# EAGLE design owl (EAGLE 6.4)
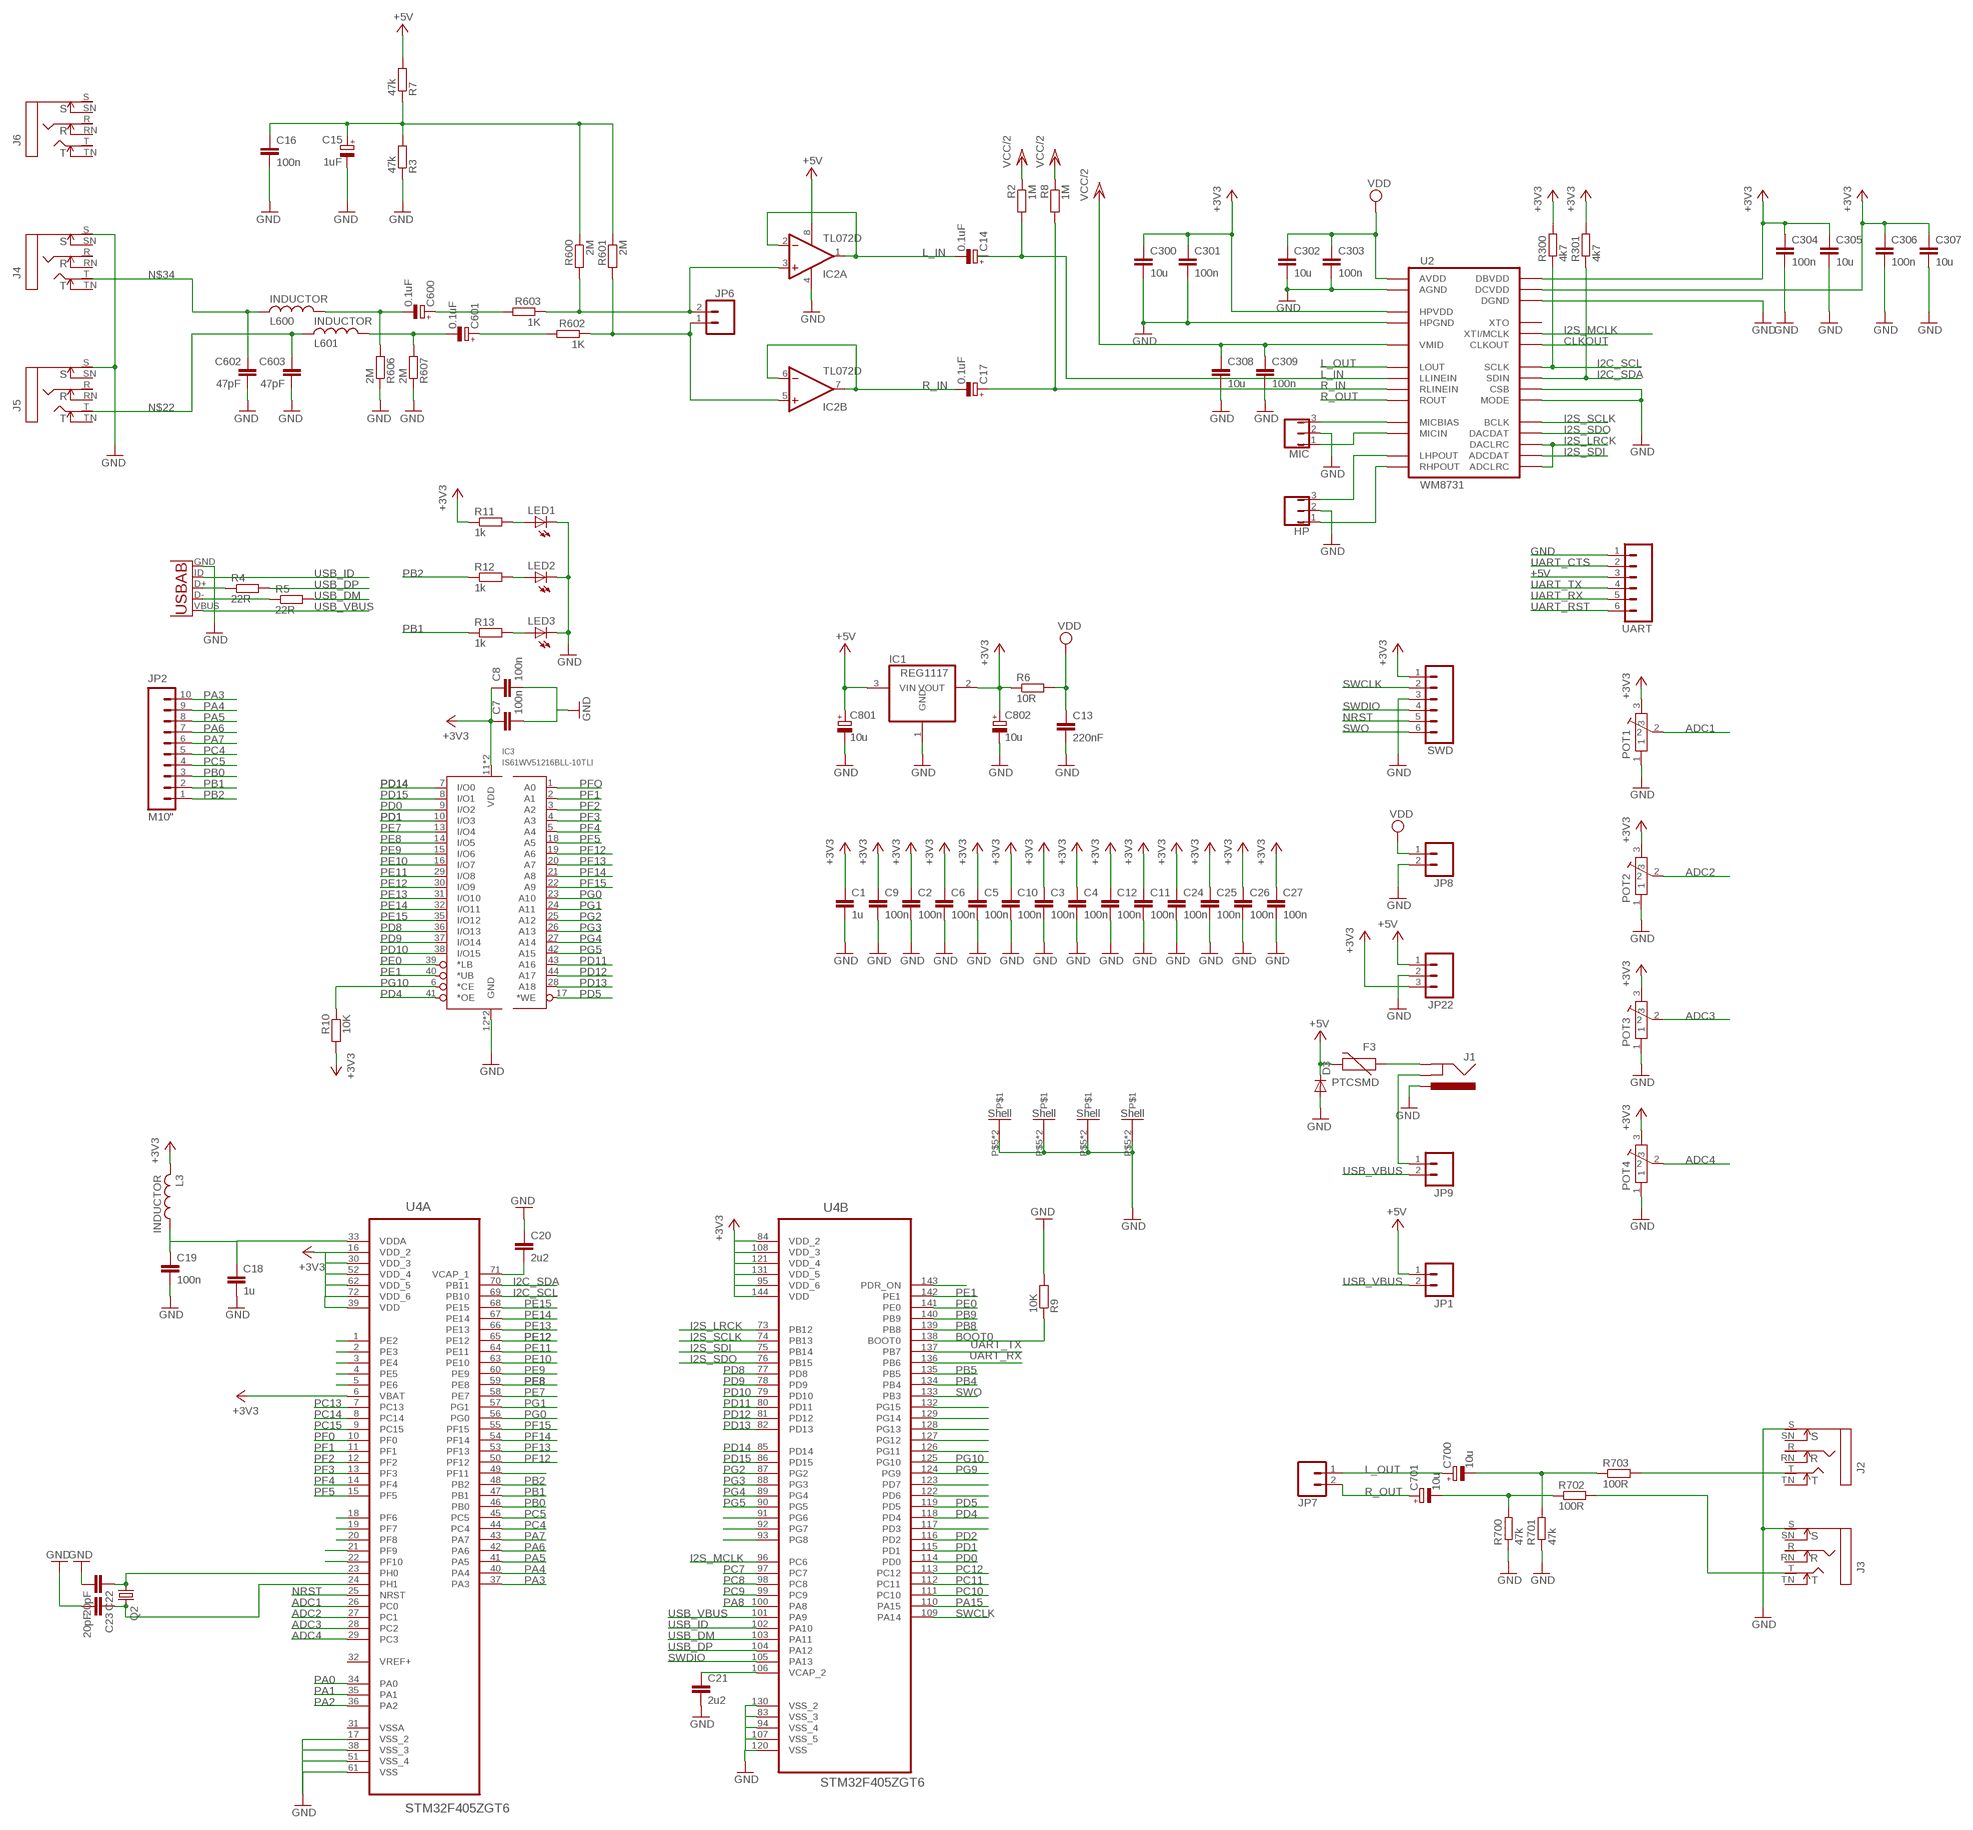
[diagram p0: schematic, sheet 1]

## Parts
C1  1u  C-EUC0603  [C0603]
C2  100n  C-EUC0603  [C0603]
C3  100n  C-EUC0603  [C0603]
C4  100n  C-EUC0603  [C0603]
C5  100n  C-EUC0603  [C0603]
C6  100n  C-EUC0603  [C0603]
C7  100n  C-EUC0603  [C0603]
C8  100n  C-EUC0603  [C0603]
C9  100n  C-EUC0603  [C0603]
C10  100n  C-EUC0603  [C0603]
C11  100n  C-EUC0603  [C0603]
C12  100n  C-EUC0603  [C0603]
C13  220nF  C-EUC0603  [C0603]
C14  0.1uF  CPOL-EUA  [PANASONIC_A]
C15  1uF  CPOL-EUA  [PANASONIC_A]
C16  100n  C-EUC0603  [C0603]
C17  0.1uF  CPOL-EUA  [PANASONIC_A]
C18  1u  C-EUC0603  [C0603]
C19  100n  C-EUC0603  [C0603]
C20  2u2  C-EUC0603  [C0603]
C21  2u2  C-EUC0603  [C0603]
C22  20pF  C-EUC0603  [C0603]
C23  20pF  C-EUC0603  [C0603]
C24  100n  C-EUC0603  [C0603]
C25  100n  C-EUC0603  [C0603]
C26  100n  C-EUC0603  [C0603]
C27  100n  C-EUC0603  [C0603]
C300  10u  C-EUC1206  [C1206]
C301  100n  C-EUC0603  [C0603]
C302  10u  C-EUC1206  [C1206]
C303  100n  C-EUC0603  [C0603]
C304  100n  C-EUC0603  [C0603]
C305  10u  C-EUC1206  [C1206]
C306  100n  C-EUC0603  [C0603]
C307  10u  C-EUC1206  [C1206]
C308  10u  C-EUC1206  [C1206]
C309  100n  C-EUC0603  [C0603]
C600  0.1uF  CPOL-EUA  [PANASONIC_A]
C601  0.1uF  CPOL-EUA  [PANASONIC_A]
C602  47pF  C-EUC0603  [C0603]
C603  47pF  C-EUC0603  [C0603]
C700  10u  CPOL-EUA  [PANASONIC_A]
C701  10u  CPOL-EUA  [PANASONIC_A]
C801  10u  CPOL-EUA  [PANASONIC_A]
C802  10u  CPOL-EUA  [PANASONIC_A]
D3  DIODESMA  [SMA-DIODE]
F3  PTCSMD  [PTC-1206]
HP  JMP/3P/SIP  [JMP/3P/SIP]
IC1  REG1117  [SOT223]
IC2  TL072D  [SO08]
IC3  IS61WV51216BLL-10TLI  [TSOP44-II]
J1  POWER_JACKPTH  [POWER_JACK_PTH]
J2  NEUTRIK_NMJ6HCD2  [NMJ6HCD2]
J3  NEUTRIK_NMJ6HCD2  [NMJ6HCD2]
J4  NEUTRIK_NMJ6HCD2  [NMJ6HCD2]
J5  NEUTRIK_NMJ6HCD2  [NMJ6HCD2]
J6  NEUTRIK_NMJ6HCD2  [NMJ6HCD2]
JP1  M02PTH  [1X02]
JP2  M10"  [1X10]
JP6  M02PTH  [1X02]
JP7  M02PTH  [1X02]
JP8  M02PTH  [1X02]
JP9  M02PTH  [1X02]
JP22  M03PTH  [1X03]
L3  INDUCTOR  [0603]
L600  INDUCTOR  [0603]
L601  INDUCTOR  [0603]
LED1  LED1206  [LED-1206]
LED2  LED1206  [LED-1206]
LED3  LED3MM  [LED3MM]
MIC  JMP/3P/SIP  [JMP/3P/SIP]
POT1  POT-ALPS-RK09L1140  [POT-ALPS-RK09L1140]
POT2  POT-ALPS-RK09L1140  [POT-ALPS-RK09L1140]
POT3  POT-ALPS-RK09L1140  [POT-ALPS-RK09L1140]
POT4  POT-ALPS-RK09L1140  [POT-ALPS-RK09L1140]
Q2  CRYSTALHC49UP  [HC49UP]
R2  1M  R-EU_R0603  [R0603]
R3  47k  R-EU_R0603  [R0603]
R4  22R  R-EU_R0603  [R0603]
R5  22R  R-EU_R0603  [R0603]
R6  10R  R-EU_R0603  [R0603]
R7  47k  R-EU_R0603  [R0603]
R8  1M  R-EU_R0603  [R0603]
R9  10K  R-EU_R0603  [R0603]
R10  10K  R-EU_R0603  [R0603]
R11  1k  R-EU_R0603  [R0603]
R12  1k  R-EU_R0603  [R0603]
R13  1k  R-EU_R0603  [R0603]
R300  4k7  R-EU_R0603  [R0603]
R301  4k7  R-EU_R0603  [R0603]
R600  2M  R-EU_R0603  [R0603]
R601  2M  R-EU_R0603  [R0603]
R602  1K  R-EU_R0603  [R0603]
R603  1K  R-EU_R0603  [R0603]
R606  2M  R-EU_R0603  [R0603]
R607  2M  R-EU_R0603  [R0603]
R700  47k  R-EU_R0603  [R0603]
R701  47k  R-EU_R0603  [R0603]
R702  100R  R-EU_R0603  [R0603]
R703  100R  R-EU_R0603  [R0603]
SWD  M06SIP  [1X06]
U2  WM8731  [28-SSOP]
U3  USB-AB  [USB-AB-MICRO-SMD]
U4  STM32F405ZGT6  [QFP50P2200X2200X160-144N]
UART  M06SIP  [1X06]

## Nets
+3V3: C1.1 C2.1 C3.1 C4.1 C5.1 C6.1 C7.1 C8.1 C9.1 C10.1 C11.1 C12.1 C24.1 C25.1 C26.1 C27.1 C300.1 C301.1 C304.1 C305.1 C306.1 C307.1 C802.+ IC1.2(VOUT) IC3.11(VDD) IC3.33(VDD) JP22.3 L3.2 POT1.3 POT2.3 POT3.3 POT4.3 R6.1 R10.2 R11.1 R300.2 R301.2 SWD.1 U2.P$1(DBVDD) U2.P$8(HPVDD) U2.P$27(DCVDD) U4.6(A:VBAT) U4.16(A:VDD_2) U4.30(A:VDD_3) U4.39(A:VDD) U4.52(A:VDD_4) U4.62(A:VDD_5) U4.72(A:VDD_6) U4.84(B:VDD_2) U4.95(B:VDD_6) U4.108(B:VDD_3) U4.121(B:VDD_4) U4.131(B:VDD_5) U4.144(B:VDD)
+5V: C801.+ D3.C F3.2 IC1.3(VIN) IC2.8(P:V+) JP1.1 JP22.1 R7.2 UART.3
ADC1: POT1.2 U4.26(A:PC0)
ADC2: POT2.2 U4.27(A:PC1)
ADC3: POT3.2 U4.28(A:PC2)
ADC4: POT4.2 U4.29(A:PC3)
BOOT0: R9.1 U4.138(B:BOOT0)
CLKOUT: U2.P$2(CLKOUT)
GND: C1.2 C2.2 C3.2 C4.2 C5.2 C6.2 C7.2 C8.2 C9.2 C10.2 C11.2 C12.2 C13.2 C15.- C16.2 C18.2 C19.2 C20.1 C21.2 C22.2 C23.2 C24.2 C25.2 C26.2 C27.2 C300.2 C301.2 C302.2 C303.2 C304.2 C305.2 C306.2 C307.2 C308.2 C309.2 C602.2 C603.2 C801.- C802.- D3.A HP.2 IC1.1(GND) IC2.4(P:V-) IC3.12(GND) IC3.34(GND) J1.PWR J2.S J3.S J4.S J5.S JP8.2 JP22.2 LED1.C LED2.C LED3.K(C) MIC.2 POT1.1 POT1.P$5 POT1.P$6 POT2.1 POT2.P$5 POT2.P$6 POT3.1 POT3.P$5 POT3.P$6 POT4.1 POT4.P$5 POT4.P$6 R3.1 R9.2 R606.1 R607.1 R700.1 R701.1 SWD.3 U2.P$11(HPGND) U2.P$15(AGND) U2.P$21(MODE) U2.P$22(CSB) U2.P$28(DGND) U3.GND U4.17(A:VSS_2) U4.38(A:VSS_3) U4.51(A:VSS_4) U4.61(A:VSS) U4.83(B:VSS_3) U4.94(B:VSS_4) U4.107(B:VSS_5) U4.120(B:VSS) U4.130(B:VSS_2) UART.1
I2C_SCL: R300.1 U2.P$24(SCLK) U4.69(A:PB10)
I2C_SDA: R301.1 U2.P$23(SDIN) U4.70(A:PB11)
I2S_LRCK: U2.P$5(DACLRC) U2.P$7(ADCLRC) U4.73(B:PB12)
I2S_MCLK: U2.P$25(XTI/MCLK) U4.96(B:PC6)
I2S_SCLK: U2.P$3(BCLK) U4.74(B:PB13)
I2S_SDI: U2.P$6(ADCDAT) U4.75(B:PB14)
I2S_SDO: U2.P$4(DACDAT) U4.76(B:PB15)
L_IN: C14.- IC2.1(A:OUT) IC2.2(A:-IN) R2.2 U2.P$20(LLINEIN)
L_OUT: C700.+ JP7.1 U2.P$12(LOUT)
N$1: MIC.3 U2.P$17(MICBIAS)
N$2: C600.- L600.1 R606.2
N$3: C601.- L601.1 R607.2
N$4: F3.1 J1.GND
N$5: J1.GNDBREAK JP9.1
N$6: U4.49(A:PF11)
N$7: C600.+ R603.2
N$8: HP.3 U2.P$9(LHPOUT)
N$9: C601.+ R602.2
N$10: LED1.A R11.2
N$11: LED2.A R12.2
N$12: C21.1 U4.106(B:VCAP_2)
N$13: LED3.A R13.2
N$14: U4.21(A:PF9)
N$15: U4.22(A:PF10)
N$17: R4.1 U3.D+
N$18: C15.+ C16.1 R3.2 R7.1 R600.1 R601.1
N$21: R5.1 U3.D-
N$22: C603.1 J5.T L601.2
N$23: C23.1 Q2.2 U4.24(A:PH1)
N$24: C22.1 Q2.1 U4.23(A:PH0)
N$29: J3.T R702.2
N$30: J2.T R703.2
N$33: C701.- R700.2 R702.1
N$34: C602.1 J4.T L600.2
N$36: C700.- R701.2 R703.1
N$37: IC2.3(A:+IN) JP6.2 R600.2 R603.1
N$38: IC2.5(B:+IN) JP6.1 R601.2 R602.1
N$43: MIC.1 U2.P$18(MICIN)
N$44: HP.1 U2.P$10(RHPOUT)
N$53: C20.2 U4.71(A:VCAP_1)
N$54: U4.91(B:PG6)
N$75: U4.128(B:PG13)
N$76: U4.129(B:PG14)
N$77: U4.132(B:PG15)
N$99: U4.117(B:PD3)
N$102: U4.122(B:PD6)
N$103: U4.123(B:PD7)
N$106: U4.126(B:PG11)
N$107: U4.127(B:PG12)
N$113: U4.143(B:PDR_ON)
N$123: U4.19(A:PF7)
N$124: U4.18(A:PF6)
N$136: U4.5(A:PE6)
N$137: U4.4(A:PE5)
N$138: U4.3(A:PE4)
N$139: U4.2(A:PE3)
N$140: U4.1(A:PE2)
N$142: U4.93(B:PG8)
N$143: U4.92(B:PG7)
NRST: SWD.5 U4.25(A:NRST)
PA0: U4.34(A:PA0)
PA1: U4.35(A:PA1)
PA2: U4.36(A:PA2)
PA3: JP2.10 U4.37(A:PA3)
PA4: JP2.9 U4.40(A:PA4)
PA5: JP2.8 U4.41(A:PA5)
PA6: JP2.7 U4.42(A:PA6)
PA7: JP2.6 U4.43(A:PA7)
PA8: U4.100(B:PA8)
PA15: U4.110(B:PA15)
PB0: JP2.3 U4.46(A:PB0)
PB1: JP2.2 R13.1 U4.47(A:PB1)
PB2: JP2.1 R12.1 U4.48(A:PB2)
PB4: U4.134(B:PB4)
PB5: U4.135(B:PB5)
PB8: U4.139(B:PB8)
PB9: U4.140(B:PB9)
PC4: JP2.5 U4.44(A:PC4)
PC5: JP2.4 U4.45(A:PC5)
PC7: U4.97(B:PC7)
PC8: U4.98(B:PC8)
PC9: U4.99(B:PC9)
PC10: U4.111(B:PC10)
PC11: U4.112(B:PC11)
PC12: U4.113(B:PC12)
PC13: U4.7(A:PC13)
PC14: U4.8(A:PC14)
PC15: U4.9(A:PC15)
PD0: IC3.9(I/O2) U4.114(B:PD0)
PD1: IC3.10(I/O3) U4.115(B:PD1)
PD2: U4.116(B:PD2)
PD4: IC3.41(*OE) U4.118(B:PD4)
PD5: IC3.17(*WE) U4.119(B:PD5)
PD8: IC3.36(I/O13) U4.77(B:PD8)
PD9: IC3.37(I/O14) U4.78(B:PD9)
PD10: IC3.38(I/O15) U4.79(B:PD10)
PD11: IC3.43(A16) U4.80(B:PD11)
PD12: IC3.44(A17) U4.81(B:PD12)
PD13: IC3.28(A18) U4.82(B:PD13)
PD14: IC3.7(I/O0) U4.85(B:PD14)
PD15: IC3.8(I/O1) U4.86(B:PD15)
PE0: IC3.39(*LB) U4.141(B:PE0)
PE1: IC3.40(*UB) U4.142(B:PE1)
PE7: IC3.13(I/O4) U4.58(A:PE7)
PE8: IC3.14(I/O5) U4.59(A:PE8)
PE9: IC3.15(I/O6) U4.60(A:PE9)
PE10: IC3.16(I/O7) U4.63(A:PE10)
PE11: IC3.29(I/O8) U4.64(A:PE11)
PE12: IC3.30(I/O9) U4.65(A:PE12)
PE13: IC3.31(I/O10) U4.66(A:PE13)
PE14: IC3.32(I/O11) U4.67(A:PE14)
PE15: IC3.35(I/O12) U4.68(A:PE15)
PF0: U4.10(A:PF0)
PF1: IC3.2(A1) U4.11(A:PF1)
PF2: IC3.3(A2) U4.12(A:PF2)
PF3: IC3.4(A3) U4.13(A:PF3)
PF4: IC3.5(A4) U4.14(A:PF4)
PF5: IC3.18(A5) U4.15(A:PF5)
PF9: U4.20(A:PF8)
PF12: IC3.19(A6) U4.50(A:PF12)
PF13: IC3.20(A7) U4.53(A:PF13)
PF14: IC3.21(A8) U4.54(A:PF14)
PF15: IC3.22(A9) U4.55(A:PF15)
PFO: IC3.1(A0)
PG0: IC3.23(A10) U4.56(A:PG0)
PG1: IC3.24(A11) U4.57(A:PG1)
PG2: IC3.25(A12) U4.87(B:PG2)
PG3: IC3.26(A13) U4.88(B:PG3)
PG4: IC3.27(A14) U4.89(B:PG4)
PG5: IC3.42(A15) U4.90(B:PG5)
PG9: U4.124(B:PG9)
PG10: IC3.6(*CE) R10.1 U4.125(B:PG10)
R_IN: C17.+ C17.- IC2.6(B:-IN) IC2.7(B:OUT) R8.2 U2.P$19(RLINEIN)
R_OUT: C701.+ JP7.2 U2.P$13(ROUT)
SWCLK: SWD.2 U4.109(B:PA14)
SWDIO: SWD.4 U4.105(B:PA13)
SWO: SWD.6 U4.133(B:PB3)
UART_CTS: UART.2
UART_RST: UART.6
UART_RX: U4.136(B:PB6) UART.5
UART_TX: U4.137(B:PB7) UART.4
USB_DM: R5.2 U4.103(B:PA11)
USB_DP: R4.2 U4.104(B:PA12)
USB_ID: U3.ID(USBID) U4.102(B:PA10)
USB_VBUS: JP1.2 JP9.2 U3.VBUS U4.101(B:PA9)
VCC/2: C308.1 C309.1 R2.1 R8.1 U2.P$16(VMID)
VDD: C13.1 C302.1 C303.1 JP8.1 R6.2 U2.P$14(AVDD)
VDDA: C18.1 C19.1 L3.1 U4.33(A:VDDA)
Unconnected: C14.+ J2.R J2.RN J2.SN J2.TN J3.R J3.RN J3.SN J3.TN J4.R J4.RN J4.SN J4.TN J5.R J5.RN J5.SN J5.TN J6.R J6.RN J6.S J6.SN J6.T J6.TN U2.P$26(XTO) U4.32(A:VREF+)

## Power pins joined to a net without a drawn wire
VSSA: U4.31(A:VSSA)

## Library data of the parts
C1-C13 C16 C18-C27 C300-C309 C602 C603 = resistor:C-EU: CAPACITOR, European symbol
C14 C15 C17 C600 C601 C700 C701 C801 C802 = resistor:CPOL-EU: POLARIZED CAPACITOR, European symbol
D3 = SparkFun:DIODE: Diode These are standard reverse protection diodes and small signal diodes. SMA package can handle up to about 1A. SOD-323 can handle about 200mA. What the SOD-323 package when ordering, there are some mfgs out there that are 5-pin packages.
F3 = SparkFun:PTC: Resettable Fuse PTC Resettable Fuse. Spark Fun Electronics SKU : COM-08357
HP MIC = audioint:JMP/3P/SIP
IC1 = burr-brown:REG1117: 800mA and 1A Low Dropout (LDO) Positive Regulator 1.8V, 2.5V, 2.85V, 3.3V, 5V, and Adj; MPN: REG1117; OC_FARNELL: 1097566; OC_NEWARK: 14P6981
IC2 = linear:TL072: OP AMP
IC3 = Rebel:IS61WV51216BLL-10TLI: IS61WV51216BLL-10TLI - SRAM, 8MBIT, 10NS, 44TSOPII Manufacturer: INTEGRATED SILICON SOLUTION (ISSI) Farnell order code: 2253837 Manufacturer Part No: IS61WV51216BLL-10TLI Product Information SRAM, 8MBIT, 10NS, 44TSOPII Memory Size: 8Mbit Memory Configuration: 512K x 16bit Supply Voltage Min: 2.4V Supply Voltage Max: 3.6V Memory Case Style: TSOPII No. of Pins: 44 Access Time: 10ns Operating Temperature Min: -40°C Operating Temperature Max: 85°C MSL: MSL 3 - 168 hours SVHC: No SVHC (19-Dec-2012) Operating Temperature Range: -40°C to +85°C Supply Voltage Range: 2.4V to 3.6V
J1 = SparkFun:POWER_JACK: Power Jack This is the standard 5.5mm barrel jack for power. The PTH is the most common, proven, reliable, footprint. All others are experimental. The Slot footprint only works if the mill layer is transmitted to the PCB fab house so be warned. Spark Fun Electronics SKU : PRT-00119. Mating wall wart : TOL-00298 (and others)
J2-J6 = neutrik_jacks:NEUTRIK_NMJ6HCD2
JP1 JP6-JP9 = SparkFun:M02: Header 2 Standard 2-pin 0.1" header. Use with straight break away headers (SKU : PRT-00116), right angle break away headers (PRT-00553), swiss pins (PRT-00743), machine pins (PRT-00117), and female headers (PRT-00115). Molex polarized connector foot print use with SKU : PRT-08233 with associated crimp pins and housings.
JP2 = SparkFun:M10: Header 10 Standard 10-pin 0.1" header. Use with straight break away headers (SKU : PRT-00116), right angle break away headers (PRT-00553), swiss pins (PRT-00743), machine pins (PRT-00117), and female headers (PRT-00115).
JP22 = SparkFun:M03: Header 3 Standard 3-pin 0.1" header. Use with straight break away headers (SKU : PRT-00116), right angle break away headers (PRT-00553), swiss pins (PRT-00743), machine pins (PRT-00117), and female headers (PRT-00115). Molex polarized connector foot print use with SKU : PRT-08232 with associated crimp pins and housings.
L3 L600 L601 = Rebel:INDUCTOR
LED1 LED2 = SparkFun:LED: LEDs Standard schematic elements and footprints for 5mm, 3mm, 1206, and 0603 sized LEDs. 5mm - Spark Fun Electronics SKU : COM-00529 (and others)
LED3 = Rebel:LED: LED
POT1-POT4 = Rebel:POT-ALPS-RK09L
Q2 = crystal:CRYSTAL: CRYSTAL; OC_FARNELL: unknown; OC_NEWARK: unknown
R2-R13 R300 R301 R600-R603 R606 R607 R700-R703 = resistor:R-EU_: RESISTOR, European symbol
SWD UART = SparkFun:M06: Header 6 Standard 6-pin 0.1" header. Use with straight break away headers (SKU : PRT-00116), right angle break away headers (PRT-00553), swiss pins (PRT-00743), machine pins (PRT-00117), and female headers (PRT-00115). Molex polarized connector foot print use with SKU : PRT-08094 with associated crimp pins and housings. NOTES ON THE VARIANTS LOCK and LOCK_LONGPADS... This footprint was designed to help hold the alignment of a through-hole component (i.e. 6-pin header) while soldering it into place. You may notice that each hole has been shifted either up or down by 0.005 of an inch from it's more standard position (which is a perfectly straight line). This slight alteration caused the pins (the squares in the middle) to touch the edges of the holes. Because they are alternating, it causes a "brace" to hold the component in place. 0.005 has proven to be the perfect amount of "off-center" position when using our standard breakaway headers. Although looks a little odd when you look at the bare footprint, once you have a header in there, the alteration is very hard to notice. Also, if you push a header all the way into place, it is covered up entirely on the bottom side. This idea of altering the position of holes to aid alignment will be further integrated into the Sparkfun Library for other footprints. It can help hold any component with 3 or more connection pins.
U2 = audioint:WM8731
U3 = SparkFun-Connectors:USB-AB: This is a USB AB connector that is compatible with USB OTG. i.e. this connector can serve as a host or device
U4 = Rebel:STM32F405ZGT6: IC, MCU, 32BIT, 1MB FLASH, 144LQFP; MPN: STM32F405ZGT6; OC_FARNELL: 2215225; OC_NEWARK: 46W2200; PACKAGE: 144LQFP; SUPPLIER: STMicroelectronics

## Board
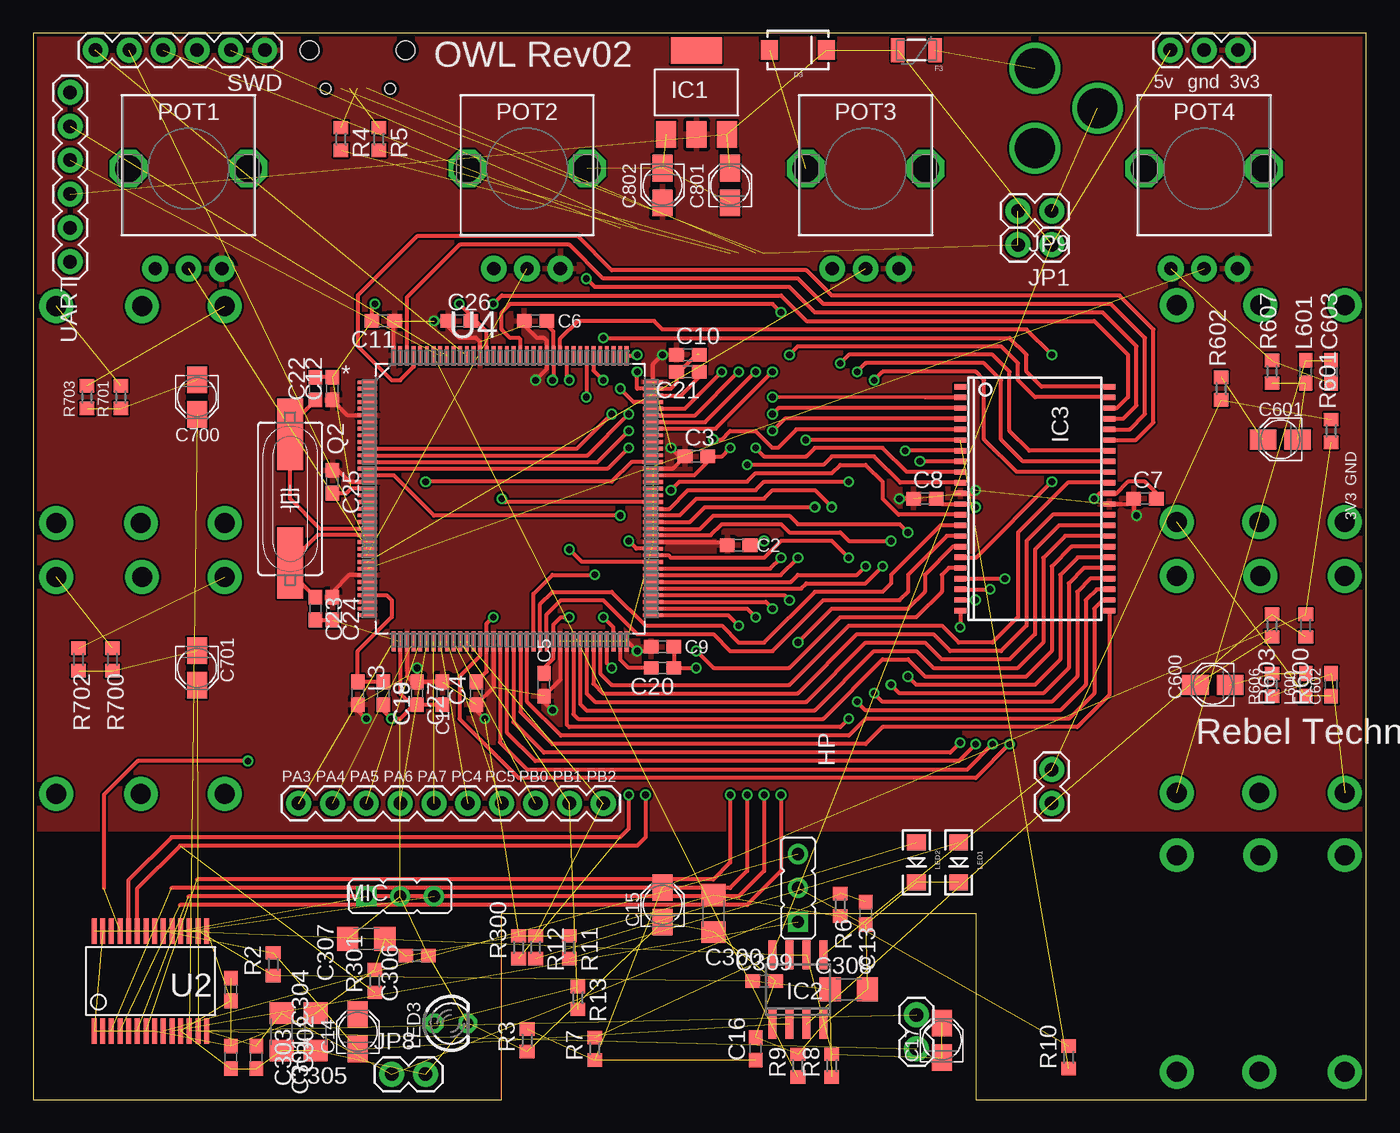
[diagram p1: board, top side]
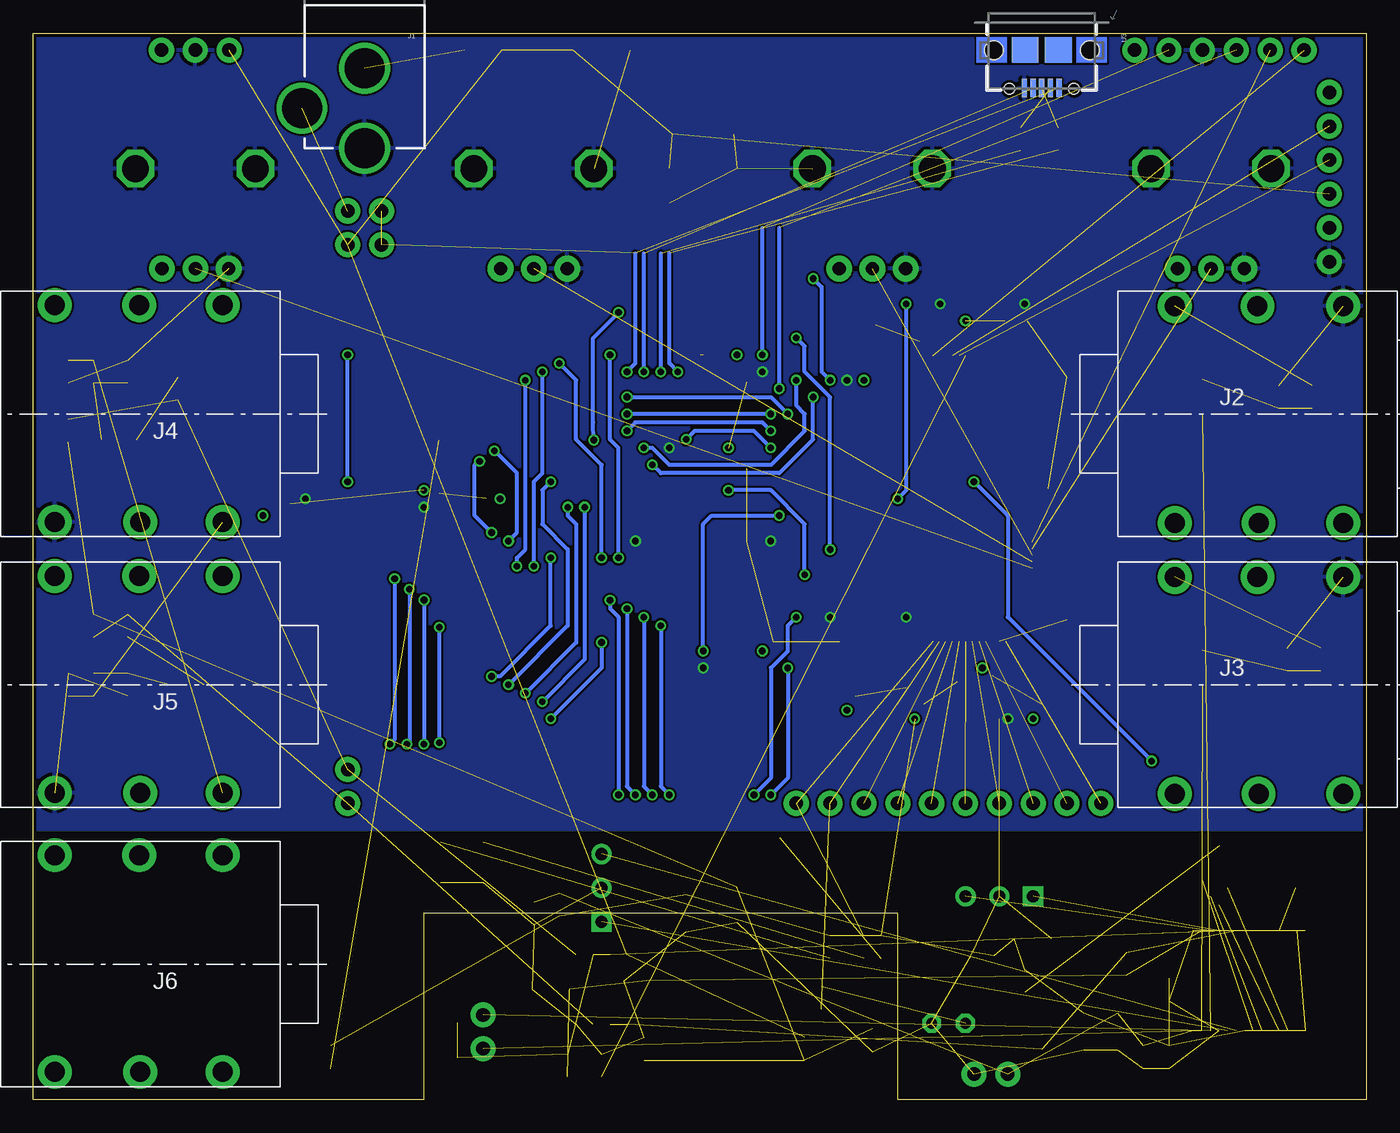
[diagram p2: board, bottom side, seen from below]

Size 100 x 80 mm. Coordinates in mm from the lower left corner, seen from the top.
Outline: 0,0 35.14,0 35.14,13.97 70.7,13.97 70.7,0 100,0 100,80 0,80 0,0
Copper layers (1*16): Top 0.035mm / dielectric 1.5mm / Bottom 0.035mm
Design rules "default *": minimum track width 6mil, minimum drill 12mil, track to track 6mil, track to pad 6mil, pad to pad 6mil, via to via 6mil, smd to smd 0mil, copper to edge 10mil, drill to drill 10mil, minimum pad ring 12mil, minimum via ring 6mil, stop-mask expansion 2mil, vias tented up to drill 100mil, thermal gap 10mil

### Footprints (pad centres in the part's own frame; a part is rotated, then mirrored left to right if it is on the bottom)
C0603 = smd 1.1 x 1: 1 -0.85,0; 2 0.85,0
PANASONIC_A = smd 2 x 1.5: + 1.3,0; - -1.3,0
C1206 = smd 1.6 x 1.8: 1 -1.4,0; 2 1.4,0
SMA-DIODE = smd 1.27 x 1.47: A -2.15,0; C 2.15,0
PTC-1206 = smd 1 x 1.8: 1 -1.4,0; 2 1.4,0
JMP/3P/SIP = drill 0.914 pad 1.524 square: 1 -2.54,0 | drill 0.914 pad 1.524: 2 0,0; 3 2.54,0
SOT223 = smd 1.499 x 2.007: 1 -2.261,-3.15; 2 0.025,-3.15; 3 2.311,-3.15 | smd 3.81 x 2.007: 4 0,3.15
SO08 = smd 0.6 x 2.2: 1 -1.905,-2.6; 2 -0.635,-2.6; 3 0.635,-2.6; 4 1.905,-2.6; 5 1.905,2.6; 6 0.635,2.6; 7 -0.635,2.6; 8 -1.905,2.6
TSOP44-II = smd 0.4 x 0.9: 1 -8.4,-5.6; 2 -7.6,-5.6; 3 -6.8,-5.6; 4 -6,-5.6; 5 -5.2,-5.6; 6 -4.4,-5.6; 7 -3.6,-5.6; 8 -2.8,-5.6; 9 -2,-5.6; 10 -1.2,-5.6; 11 -0.4,-5.6; 12 0.4,-5.6; 13 1.2,-5.6; 14 2,-5.6; 15 2.8,-5.6; 16 3.6,-5.6; 17 4.4,-5.6; 18 5.2,-5.6; 19 6,-5.6; 20 6.8,-5.6; 21 7.6,-5.6; 22 8.4,-5.6; 23 8.4,5.6; 24 7.6,5.6; 25 6.8,5.6; 26 6,5.6; 27 5.2,5.6; 28 4.4,5.6; 29 3.6,5.6; 30 2.8,5.6; 31 2,5.6; 32 1.2,5.6; 33 0.4,5.6; 34 -0.4,5.6; 35 -1.2,5.6; 36 -2,5.6; 37 -2.8,5.6; 38 -3.6,5.6; 39 -4.4,5.6; 40 -5.2,5.6; 41 -6,5.6; 42 -6.8,5.6; 43 -7.6,5.6; 44 -8.4,5.6
POWER_JACK_PTH = drill 2.997: GND 0,7.7; GNDBREAK 4.7,10.7; PWR 0,13.7
NMJ6HCD2 = drill 1.5 pad 2.54: R -0.318,8.096; RN -0.238,-8.176; S 6.112,8.096; SN 6.112,-8.176; T -6.509,8.096; TN -6.509,-8.176
1X02 = drill 1.016 pad 1.88: 1 0,0; 2 2.54,0
1X10 = drill 1.016 pad 1.88: 1 0,0; 2 2.54,0; 3 5.08,0; 4 7.62,0; 5 10.16,0; 6 12.7,0; 7 15.24,0; 8 17.78,0; 9 20.32,0; 10 22.86,0
1X03 = drill 1.016 pad 1.88: 1 0,0; 2 2.54,0; 3 5.08,0
0603 = smd 1.1 x 1: 1 -0.85,0; 2 0.85,0
LED-1206 = smd 1.2 x 1.4: A -1.5,0; C 1.5,0
LED3MM = drill 0.813 octagon: A -1.27,0; K 1.27,0
POT-ALPS-RK09L1140 = drill 1 pad 1.93: 1 -2.5,-7.5; 2 0,-7.5; 3 2.5,-7.5 | drill 2 octagon: P$5 -4.5,0; P$6 4.5,0
HC49UP = smd 5.334 x 1.93: 1 -4.826,0; 2 4.826,0
R0603 = smd 1 x 1.1: 1 -0.85,0; 2 0.85,0
1X06 = drill 1.016 pad 1.88: 1 0,0; 2 2.54,0; 3 5.08,0; 4 7.62,0; 5 10.16,0; 6 12.7,0
28-SSOP = smd 0.381 x 1.905: P$1 -4.55,-3.752; P$2 -3.9,-3.752; P$3 -3.25,-3.752; P$4 -2.6,-3.752; P$5 -1.95,-3.752; P$6 -1.3,-3.752; P$7 -0.65,-3.752; P$8 0,-3.752; P$9 0.65,-3.752; P$10 1.3,-3.752; P$11 1.95,-3.752; P$12 2.6,-3.752; P$13 3.25,-3.752; P$14 3.9,-3.752; P$15 3.9,3.752; P$16 3.25,3.752; P$17 2.6,3.752; P$18 1.95,3.752; P$19 1.3,3.752; P$20 0.65,3.752; P$21 0,3.752; P$22 -0.65,3.752; P$23 -1.3,3.752; P$24 -1.95,3.752; P$25 -2.6,3.752; P$26 -3.25,3.752; P$27 -3.9,3.752; P$28 -4.55,3.752
USB-AB-MICRO-SMD = smd 1.4 x 0.4: D+ 2.85,0; D- 2.85,0.65; GND 2.85,-1.3; ID 2.85,-0.65; VBUS 2.85,1.3 | smd 1.9 x 2: P$6 0,1.25; P$7 0,-1.25 | hole 1.4: 0,3.6; 0,-3.6 | hole 0.8: 2.9,2.425; 2.9,-2.425
QFP50P2200X2200X160-144N = smd 1.473 x 0.279: 1 -10.719,8.738; 2 -10.719,8.255; 3 -10.719,7.747; 4 -10.719,7.239; 5 -10.719,6.756; 6 -10.719,6.248; 7 -10.719,5.74; 8 -10.719,5.258; 9 -10.719,4.75; 10 -10.719,4.242; 11 -10.719,3.759; 12 -10.719,3.251; 13 -10.719,2.743; 14 -10.719,2.261; 15 -10.719,1.753; 16 -10.719,1.245; 17 -10.719,0.762; 18 -10.719,0.254; 19 -10.719,-0.254; 20 -10.719,-0.762; 21 -10.719,-1.245; 22 -10.719,-1.753; 23 -10.719,-2.261; 24 -10.719,-2.743; 25 -10.719,-3.251; 26 -10.719,-3.759; 27 -10.719,-4.242; 28 -10.719,-4.75; 29 -10.719,-5.258; 30 -10.719,-5.74; 31 -10.719,-6.248; 32 -10.719,-6.756; 33 -10.719,-7.239; 34 -10.719,-7.747; 35 -10.719,-8.255; 36 -10.719,-8.738; 73 10.719,-8.738; 74 10.719,-8.255; 75 10.719,-7.747; 76 10.719,-7.239; 77 10.719,-6.756; 78 10.719,-6.248; 79 10.719,-5.74; 80 10.719,-5.258; 81 10.719,-4.75; 82 10.719,-4.242; 83 10.719,-3.759; 84 10.719,-3.251; 85 10.719,-2.743; 86 10.719,-2.261; 87 10.719,-1.753; 88 10.719,-1.245; 89 10.719,-0.762; 90 10.719,-0.254; 91 10.719,0.254; 92 10.719,0.762; 93 10.719,1.245; 94 10.719,1.753; 95 10.719,2.261; 96 10.719,2.743; 97 10.719,3.251; 98 10.719,3.759; 99 10.719,4.242; 100 10.719,4.75; 101 10.719,5.258; 102 10.719,5.74; 103 10.719,6.248; 104 10.719,6.756; 105 10.719,7.239; 106 10.719,7.747; 107 10.719,8.255; 108 10.719,8.738 | smd 0.279 x 1.473: 37 -8.738,-10.719; 38 -8.255,-10.719; 39 -7.747,-10.719; 40 -7.239,-10.719; 41 -6.756,-10.719; 42 -6.248,-10.719; 43 -5.74,-10.719; 44 -5.258,-10.719; 45 -4.75,-10.719; 46 -4.242,-10.719; 47 -3.759,-10.719; 48 -3.251,-10.719; 49 -2.743,-10.719; 50 -2.261,-10.719; 51 -1.753,-10.719; 52 -1.245,-10.719; 53 -0.762,-10.719; 54 -0.254,-10.719; 55 0.254,-10.719; 56 0.762,-10.719; 57 1.245,-10.719; 58 1.753,-10.719; 59 2.261,-10.719; 60 2.743,-10.719; 61 3.251,-10.719; 62 3.759,-10.719; 63 4.242,-10.719; 64 4.75,-10.719; 65 5.258,-10.719; 66 5.74,-10.719; 67 6.248,-10.719; 68 6.756,-10.719; 69 7.239,-10.719; 70 7.747,-10.719; 71 8.255,-10.719; 72 8.738,-10.719; 109 8.738,10.719; 110 8.255,10.719; 111 7.747,10.719; 112 7.239,10.719; 113 6.756,10.719; 114 6.248,10.719; 115 5.74,10.719; 116 5.258,10.719; 117 4.75,10.719; 118 4.242,10.719; 119 3.759,10.719; 120 3.251,10.719; 121 2.743,10.719; 122 2.261,10.719; 123 1.753,10.719; 124 1.245,10.719; 125 0.762,10.719; 126 0.254,10.719; 127 -0.254,10.719; 128 -0.762,10.719; 129 -1.245,10.719; 130 -1.753,10.719; 131 -2.261,10.719; 132 -2.743,10.719; 133 -3.251,10.719; 134 -3.759,10.719; 135 -4.242,10.719; 136 -4.75,10.719; 137 -5.258,10.719; 138 -5.74,10.719; 139 -6.248,10.719; 140 -6.756,10.719; 141 -7.239,10.719; 142 -7.747,10.719; 143 -8.255,10.719; 144 -8.738,10.719

### Placement (x,y rotation side)
C1  30.7,30.48 270 top
C2  52.92,41.59 0 top
C3  49.75,48.26 0 top
C4  33.24,30.48 90 top
C5  38.32,31.11 90 top
C6  37.68,58.42 0 top
C7  83.4,45.09 0 top
C8  66.89,45.09 0 top
C9  47.21,33.97 0 top
C10  49.11,55.88 0 top
C11  26.25,58.42 180 top
C12  22.44,53.34 90 top
C13  62.45,13.97 270 top
C14  24.35,5.08 90 top
C15  47.21,14.61 90 top
C16  54.19,3.81 90 top
C17  68.16,4.45 90 top
C18  26.25,30.48 270 top
C19  26.25,30.48 270 top
C20  47.21,32.38 180 top
C21  49.11,54.61 180 top
C22  21.17,53.34 90 top
C23  21.17,36.83 270 top
C24  22.44,36.83 270 top
C25  22.44,46.35 270 top
C26  31.97,58.42 0 top
C27  28.79,30.48 270 top
C300  51.02,13.97 270 top
C301  14.82,3.17 270 top
C302  18.63,5.08 270 top
C303  16.73,3.17 270 top
C304  14.82,8.26 270 top
C305  21.17,5.08 270 top
C306  28.79,10.79 0 top
C307  24.98,12.06 180 top
C308  61.18,8.26 0 top
C309  54.83,8.89 0 top
C600  88.48,31.11 180 top
C601  93.56,49.53 180 top
C602  97.37,31.11 90 top
C603  97.37,54.61 270 top
C700  12.28,52.7 270 top
C701  12.28,32.38 270 top
C801  52.29,68.58 90 top
C802  47.21,68.58 270 top
D3  57.37,78.74 0 top
F3  66.26,78.74 180 top
HP  57.37,15.88 90 top
IC1  49.75,75.56 0 top
IC2  57.37,8.26 0 top
IC3  75.15,45.09 270 top
J1  75.15,85.09 180 bottom
J2  7.84,51.44 0 bottom
J3  7.84,31.11 0 bottom
J4  92.29,51.44 180 bottom
J5  92.29,31.11 180 bottom
J6  92.29,10.16 180 bottom
JP1  76.42,64.14 180 top
JP2  42.76,22.23 180 top
JP6  76.42,24.77 270 top
JP7  66.26,6.35 270 top
JP8  26.89,1.91 0 top
JP9  76.42,66.67 180 top
JP22  85.31,78.74 0 top
L3  24.35,30.48 270 top
L600  95.47,31.11 270 top
L601  95.47,54.61 90 top
LED1  69.43,17.78 270 top
LED2  66.26,17.78 270 top
LED3  31.33,5.71 0 top
MIC  27.52,15.24 0 top
POT1  11.65,69.85 0 top
POT2  37.05,69.85 0 top
POT3  62.45,69.85 0 top
POT4  87.85,69.85 0 top
Q2  19.27,45.09 270 top
R2  18,10.16 90 top
R3  37.05,4.45 90 top
R4  23.08,72.07 270 top
R5  25.93,72.07 270 top
R6  60.54,14.61 90 top
R7  42.13,3.81 90 top
R8  59.91,2.54 90 top
R9  57.37,2.54 90 top
R10  77.69,3.17 90 top
R11  40.22,11.43 270 top
R12  37.68,11.43 270 top
R13  40.86,7.62 90 top
R300  36.41,11.43 90 top
R301  25.62,8.89 90 top
R600  95.47,35.56 270 top
R601  97.37,50.16 90 top
R602  89.12,53.34 90 top
R603  92.93,35.56 270 top
R606  92.93,31.11 90 top
R607  92.93,54.61 270 top
R700  5.93,33.02 270 top
R701  6.57,52.7 270 top
R702  3.39,33.02 90 top
R703  4.03,52.7 90 top
SWD  17.36,78.74 180 top
U2  9.11,8.89 0 top
U3  24.35,78.74 270 bottom
U4  35.78,45.09 0 top
UART  2.76,62.87 90 top

### Tracks (layer width: path | path; a pad name or v marks a point on that pad's centre or on a via)
+3V3  (via drill 0.5)  (25 unrouted)
  Top 0.305: U4.72 44.59,34.37 v45.3,33.66 46.04,33.66 C9.1 | C8.1 v64.99,45.09 | IC3.11 70.47,45.48 v70.7,45.72 | IC3.33 82.15,44.69 C7.1 82.55,44.03 v82.77,43.81 | U4.108 46.5,55.17 v47.21,55.88 | v37.68,53.98 38.52,54.81 U4.121 38.52,56.95 38.32,57.15 37.78,57.15 36.83,58.1 C6.1 | U4.84 51.83,41.83 C2.1 | U4.62 39.54,31.48 C5.1 38.32,29.84 v38.95,29.21 | U4.95 47.98,47.35 C3.1 48.48,48.26 v47.84,48.9 | U4.52 34.53,30.93 C4.1 33.24,29.21 v33.87,28.57 | U4.131 33.52,56.87 33.24,57.15 31.97,57.15 31.12,58 C26.1 v30.06,58.42 | U4.144 27.04,58.36 C11.1 | U4.6 23.6,51.33 C12.1 | C24.1 22.44,38.1 23.69,39.34 U4.30 | U4.16 23.74,46.33 22.86,47.2 C25.1 | U4.39 28.03,31.77 28.47,31.33 C27.1 | L3.2 24.35,29.21 v24.98,28.57 | C1.1 C27.1 | v28.79,32.38 C27.1
  pour Top: -1.05,80.64 -1.05,20.32 100.55,20.32 100.55,80.64
+5V  (8 unrouted)
ADC1  (1 unrouted)
ADC2  (1 unrouted)
ADC3  (1 unrouted)
ADC4  (1 unrouted)
BOOT0  (1 unrouted)
GND  (via drill 0.5)  (41 unrouted)
  Top 0.305: v49.75,32.38 C20.1 C9.2 | C8.2 68.14,44.69 IC3.12 70.47,44.69 v70.7,44.45 | v79.59,45.09 79.99,45.48 IC3.34 81.26,45.48 82.13,46.35 83.4,46.35 84.25,45.51 C7.2 | 49.75,55.88 48.48,54.61 C21.2 48.26,53.76 47.84,53.34 U4.107 45.3,53.34 v45.3,54.61 | v38.95,53.98 39.03,54.05 U4.120 39.03,57.61 38.53,58.1 C6.2 | C2.2 53.77,41.7 v54.83,41.91 | v40.22,36.2 39.59,36.2 39.03,35.64 U4.61 39.03,33.1 38.32,32.38 C5.2 | v52.29,48.9 51.65,48.26 C3.2 50.6,47.84 49.59,46.84 U4.94 | C4.2 34.02,32.12 U4.51 34.02,35.71 v34.51,36.2 | U4.130 34.02,57.63 33.24,58.42 C26.2 32.82,58.84 v31.97,59.69 | C11.2 25.4,59.48 v25.62,59.69 | C12.2 C22.2 | C23.2 C24.2 | U4.17 23.84,45.85 23.5,45.51 C25.2 | U4.38 27.52,30.48 28.37,29.63 C27.2 | U4.83 45.25,41.33 v44.67,41.91 | C19.2 26.25,29.21 v26.89,28.57 27.52,28.57 28.58,29.63 C27.2 | C27.2 C1.2
  pour Bottom: -1.05,20.32 -1.05,80.64 100.55,80.64 100.55,20.32
I2C_SCL  (via drill 0.5)  (1 unrouted)
  Top 0.305: U4.69 43.02,32.77 v43.4,32.38 | v44.67,22.86 44.67,20.32 44.03,19.68 10.38,19.68 7.16,16.46 U2.P$24
  Bottom 0.305: v43.4,32.38 43.4,24.13 v44.67,22.86
I2C_SDA  (via drill 0.5)  (1 unrouted)
  Top 0.305: U4.70 43.52,35.43 v42.76,36.2 | v45.94,22.86 45.94,19.68 45.3,19.05 11.01,19.05 7.81,15.85 U2.P$23
  Bottom 0.305: v45.94,22.86 44.67,24.13 44.67,32.38 43.4,33.66 43.4,35.56 v42.76,36.2
I2S_LRCK  (via drill 0.5)  (2 unrouted)
  Top 0.305: U4.73 52.13,36.35 v52.92,35.56 | v52.29,22.86 52.29,17.78 51.02,16.51 12.28,16.51
  Bottom 0.305: v52.92,35.56 52.92,23.5 v52.29,22.86
I2S_MCLK  (via drill 0.5)  (1 unrouted)
  Top 0.305: U4.96 44.87,47.83 43.4,46.35 v29.43,46.35 | v16.09,25.4 7.84,25.4 5.3,22.86 5.3,15.88
  Bottom 0.305: v29.43,46.35 26.89,43.81 26.89,36.2 v16.09,25.4
I2S_SCLK  (via drill 0.5)  (1 unrouted)
  Top 0.305: U4.74 53.56,36.83 v54.19,36.2 | v53.56,22.86 53.56,17.14 52.29,15.88 10.38,15.88
  Bottom 0.305: v54.19,36.2 54.19,23.5 v53.56,22.86
I2S_SDI  (via drill 0.5)  (1 unrouted)
  Top 0.305: U4.75 54.95,37.34 v55.46,36.83 | v54.83,22.86 54.83,17.14 52.92,15.24 11.65,15.24
  Bottom 0.305: v55.46,36.83 55.46,23.5 v54.83,22.86
I2S_SDO  (via drill 0.5)  (1 unrouted)
  Top 0.305: U4.76 56.35,37.85 v56.73,37.47 | v56.1,22.86 56.1,17.14 53.56,14.61 11.01,14.61
  Bottom 0.305: v56.73,37.47 56.73,36.83 56.1,36.2 v56.1,22.86
L_IN  (4 unrouted)
L_OUT  (2 unrouted)
N$1  (1 unrouted)
N$2  (2 unrouted)
N$3  (2 unrouted)
N$4  (1 unrouted)
N$5  (1 unrouted)
N$7  (1 unrouted)
N$8  (1 unrouted)
N$9  (1 unrouted)
N$10  (1 unrouted)
N$11  (1 unrouted)
N$12
  Top 0.305: U4.106 48.6,52.83 49.96,54.19 C21.1
N$13  (1 unrouted)
N$17  (1 unrouted)
N$18  (5 unrouted)
N$21  (1 unrouted)
N$22  (2 unrouted)
N$23
  Top 0.305: U4.24 21.35,42.34 Q2.2 19.27,39.59 C23.1
N$24
  Top 0.305: U4.23 21.53,42.82 19.27,45.09 Q2.1 | Q2.1 19.27,49.53 | Q2.1 19.27,50.59 C22.1
N$29  (1 unrouted)
N$30  (1 unrouted)
N$33  (2 unrouted)
N$34  (2 unrouted)
N$36  (2 unrouted)
N$37  (3 unrouted)
N$38  (3 unrouted)
N$43  (1 unrouted)
N$44  (1 unrouted)
N$53
  Top 0.305: U4.71 44.03,33.02 44.67,32.38 C20.2
NRST  (1 unrouted)
PA3  (1 unrouted)
PA4  (1 unrouted)
PA5  (1 unrouted)
PA6  (1 unrouted)
PA7  (1 unrouted)
PB0  (1 unrouted)
PB1  (2 unrouted)
PB2  (2 unrouted)
PC4  (1 unrouted)
PC5  (1 unrouted)
PD0  (via drill 0.5)
  Top 0.305: IC3.9 65.53,47.09 63.72,48.9 58.64,48.9 58,48.26 54.83,48.26 v54.19,48.9 | U4.114 42.02,54.71 v42.76,53.98
  Bottom 0.305: v42.76,53.98 42.76,52.07 42.13,51.44 42.13,50.16 44.67,47.62 52.29,47.62 53.56,48.9 v54.19,48.9
PD1  (via drill 0.5)
  Top 0.305: IC3.10 65.06,46.28 63.08,48.26 59.91,48.26 59.27,47.62 v53.56,47.62 | U4.115 41.52,52.73 v41.49,52.7
  Bottom 0.305: v53.56,47.62 52.92,46.99 44.03,46.99 41.49,49.53 v41.49,52.7
PD4  (via drill 0.5)
  Top 0.305: IC3.41 81.78,51.09 82.77,52.07 82.77,56.52 80.23,59.05 58.64,59.05 56.73,60.96 42.13,60.96 v41.49,61.59 | U4.118 40.02,54.18 v40.22,53.98
  Bottom 0.305: v41.49,61.59 40.86,60.96 40.86,54.61 v40.22,53.98
PD5  (via drill 0.5)
  Top 0.305: IC3.17 70.75,40.69 v76.42,46.35 | v76.42,55.88 74.51,57.78 47.21,57.78 46.57,58.42 40.86,58.42 39.54,57.1 U4.119
  Bottom 0.305: v76.42,46.35 v76.42,55.88
PD8  (via drill 0.5)
  Top 0.305: IC3.36 73.78,47.09 71.34,49.53 71.34,53.98 70.7,54.61 63.72,54.61 v63.08,53.98 | v63.72,40.01 62.45,38.73 58,38.73 57.6,38.33 U4.77
  Bottom 0.305: v63.72,40.01 63.72,40.64 63.08,41.27 v63.08,53.98
PD9  (via drill 0.5)
  Top 0.305: IC3.37 74.25,47.88 72.61,49.53 72.61,53.98 71.34,55.24 62.45,55.24 v61.81,54.61 | v62.45,40.01 61.81,39.37 57.37,39.37 56.83,38.84 U4.78
  Bottom 0.305: v62.45,40.01 62.45,46.35 61.81,46.99 v61.81,54.61
PD10  (via drill 0.5)
  Top 0.305: IC3.38 74.72,48.69 73.24,50.16 73.24,54.61 71.97,55.88 61.18,55.88 v60.54,55.24 | U4.79 56.07,39.34 v57.37,40.64
  Bottom 0.305: v57.37,40.64 57.37,47.62 59.27,49.53 59.27,53.98 v60.54,55.24
PD11  (via drill 0.5)
  Top 0.305: U4.80 55.28,39.83 v56.1,40.64 | v56.73,55.88 57.37,56.52 72.61,56.52 73.88,55.24 73.88,53.98 75.15,52.7 80.73,52.7 IC3.43
  Bottom 0.305: v56.1,40.64 56.1,48.9 56.73,49.53 v56.73,55.88
PD12  (via drill 0.5)
  Top 0.305: U4.81 41.16,40.34 v40.22,41.27 | v42.76,57.15 73.24,57.15 74.51,55.88 74.51,54.61 75.64,53.48 IC3.44
  Bottom 0.305: v40.22,41.27 40.22,52.7 42.13,54.61 42.13,56.52 v42.76,57.15
PD13  (via drill 0.5)
  Top 0.305: IC3.28 78.37,40.69 77.05,39.37 77.05,33.02 75.15,31.11 66.26,31.11 v65.62,31.75 | U4.82 47.64,40.84 47.84,40.64 54.83,40.64 56.1,41.91 59.91,41.91 v61.18,40.64
  Bottom 0.305: v65.62,31.75 64.99,31.75 61.18,35.56 v61.18,40.64
PD14  (via drill 0.5)
  Top 0.305: IC3.7 v65.41,48.69 | U4.85 50.81,42.34 51.65,43.18 56.1,43.18 56.73,42.55 60.54,42.55 61.18,41.91 v64.35,41.91
  Bottom 0.305: v65.41,48.69 63.72,46.99 63.72,42.55 v64.35,41.91
PD15  (via drill 0.5)
  Top 0.305: IC3.8 v66.52,47.88 | U4.86 50.03,42.82 51.02,43.81 56.73,43.81 57.37,43.18 64.99,43.18 v65.62,42.55
  Bottom 0.305: v66.52,47.88 66.89,47.62 66.89,43.81 v65.62,42.55
PE0
  Top 0.305: IC3.39 82.72,49.48 84.04,50.8 84.04,57.78 81.5,60.33 59.91,60.33 58,62.23 43.4,62.23 40.86,64.77 28.79,64.77 24.35,60.33 24.35,56.52 26.89,53.98 27.52,53.98 28.54,54.99 U4.141
PE1
  Top 0.305: IC3.40 82.25,50.28 83.4,51.44 83.4,57.15 80.86,59.69 59.27,59.69 57.37,61.59 42.76,61.59 40.22,64.14 31.97,64.14 28.03,60.2 U4.142
PE7  (via drill 0.5)
  Top 0.305: U4.58 37.53,37.95 38.95,39.37 v42.13,39.37 | v47.84,45.72 48.48,46.35 53.56,46.35 54.19,46.99 59.91,46.99 60.54,47.62 62.45,47.62 63.72,46.35 63.72,45.09 64.92,43.88 IC3.13
  Bottom 0.305: v42.13,39.37 42.13,43.18 44.67,45.72 v47.84,45.72
PE8
  Top 0.305: IC3.14 68.07,43.09 64.35,39.37 64.35,38.73 63.72,38.1 58.64,38.1 54.83,34.29 52.92,34.29 51.65,35.56 45.94,35.56 43.4,38.1 38.95,38.1 38.04,37.19 U4.59
PE9
  Top 0.305: IC3.15 68.54,42.28 65.62,39.37 65.62,38.1 64.99,37.47 59.27,37.47 55.46,33.66 52.29,33.66 51.02,34.92 45.3,34.92 42.76,37.47 39.59,37.47 38.52,36.4 U4.60
PE10  (via drill 0.5)
  Top 0.305: IC3.16 69.01,41.48 66.89,39.37 66.89,38.1 65.62,36.83 59.91,36.83 v57.37,34.29 | v61.18,28.57 60.54,27.94 40.22,27.94 40.02,28.14 U4.63
  Bottom 0.305: v57.37,34.29 57.37,32.38 v61.18,28.57
PE11
  Top 0.305: IC3.29 77.9,41.48 76.42,40.01 76.42,33.66 74.51,31.75 66.89,31.75 65.62,33.02 63.72,33.02 59.27,28.57 40.86,28.57 40.53,28.91 U4.64
PE12
  Top 0.305: IC3.30 77.43,42.28 75.78,40.64 75.78,34.29 73.88,32.38 67.53,32.38 66.26,33.66 63.08,33.66 58.64,29.21 41.49,29.21 41.03,29.67 U4.65
PE13
  Top 0.305: IC3.31 76.96,43.09 75.15,41.27 75.15,34.92 73.24,33.02 68.16,33.02 66.89,34.29 62.45,34.29 58,29.84 42.13,29.84 41.52,30.45 U4.66
PE14
  Top 0.305: IC3.32 76.49,43.88 74.51,41.91 74.51,35.56 72.61,33.66 68.8,33.66 67.53,34.92 61.81,34.92 57.37,30.48 42.76,30.48 42.02,31.22 U4.67
PE15
  Top 0.305: IC3.35 77.62,46.28 73.88,42.55 73.88,36.2 71.97,34.29 69.43,34.29 68.16,35.56 61.18,35.56 56.73,31.11 43.4,31.11 42.53,31.98 U4.68
PF1  (via drill 0.5)
  Top 0.305: IC3.2 66.91,52.69 v55.46,52.7 | U4.11 40.8,48.84 v43.4,51.44
  Bottom 0.305: v55.46,52.7 44.67,52.7 v43.4,51.44
PF2  (via drill 0.5)
  Top 0.305: IC3.3 55.91,51.88 v55.46,51.44 | U4.12 41.57,48.34 v44.67,51.44
  Bottom 0.305: v44.67,51.44 v55.46,51.44
PF3  (via drill 0.5)
  Top 0.305: IC3.4 56.38,51.09 v55.46,50.16 | v44.67,50.16 42.33,47.83 U4.13
  Bottom 0.305: v44.67,50.16 45.3,50.8 54.83,50.8 v55.46,50.16
PF4  (via drill 0.5)
  Top 0.305: IC3.5 57.25,50.28 55.86,48.9 55.46,48.9 54.19,50.16 52.29,50.16 51.65,49.53 v51.02,49.53 | v44.67,48.9 43.12,47.35 U4.14
  Bottom 0.305: v44.67,48.9 45.94,50.16 50.38,50.16 v51.02,49.53
PF5  (via drill 0.5)
  Top 0.305: IC3.18 68.68,39.88 68.16,39.37 68.16,38.1 66.26,36.2 60.54,36.2 56.73,32.38 51.02,32.38 v49.75,33.66 | U4.15 27.04,46.84 30.06,43.81 v44.03,43.81
  Bottom 0.305: v49.75,33.66 49.75,43.18 49.11,43.81 v44.03,43.81
PF12  (via drill 0.5)
  Top 0.305: IC3.19 v72.89,39.09 | v73.24,26.67 70.7,24.13 36.41,24.13 31.97,28.57 31.97,31.75 33.52,33.3 U4.50
  Bottom 0.305: v72.89,39.09 72.89,27.02 v73.24,26.67
PF13  (via drill 0.5)
  Top 0.305: U4.53 35.01,26.8 37.05,24.77 70.07,24.77 v71.97,26.67 | IC3.20 v71.79,38.28
  Bottom 0.305: v71.79,38.28 71.79,26.86 v71.97,26.67
PF14  (via drill 0.5)
  Top 0.305: IC3.21 v70.68,37.48 | U4.54 35.52,27.56 37.68,25.4 69.43,25.4 v70.7,26.67
  Bottom 0.305: v70.68,37.48 70.68,27.32 v70.7,26.67
PF15  (via drill 0.5)
  Top 0.305: IC3.22 v69.55,35.45 | U4.55 36.03,28.32 38.32,26.04 68.8,26.04 v69.55,26.79
  Bottom 0.305: v69.55,35.45 v69.55,26.79
PG0
  Top 0.305: IC3.23 80.75,30.36 78.32,27.94 63.72,27.94 62.45,26.67 38.95,26.67 36.54,29.08 U4.56
PG1
  Top 0.305: IC3.24 80.25,37.48 79.59,36.83 79.59,30.48 77.69,28.57 62.45,28.57 61.18,27.3 39.59,27.3 37.02,29.87 U4.57
PG2  (via drill 0.5)
  Top 0.305: IC3.25 79.78,38.28 78.96,37.47 78.96,31.11 77.05,29.21 62.45,29.21 v61.81,29.84 | U4.87 49.26,43.33 50.38,44.45 v58.64,44.45
  Bottom 0.305: v58.64,44.45 58.64,33.02 v61.81,29.84
PG3  (via drill 0.5)
  Top 0.305: IC3.26 79.31,39.09 78.32,38.1 78.32,31.75 76.42,29.84 63.72,29.84 v63.08,30.48 | U4.88 48.5,43.84 49.75,45.09 54.83,45.09 55.46,45.72 58.64,45.72 v59.91,44.45
  Bottom 0.305: v59.91,44.45 59.91,43.81 59.27,43.18 59.27,34.29 v63.08,30.48
PG4  (via drill 0.5)
  Top 0.305: IC3.27 78.84,39.88 77.69,38.73 77.69,32.38 75.78,30.48 64.99,30.48 v64.35,31.11 | U4.89 47.71,44.32 49.11,45.72 54.19,45.72 54.83,46.35 v61.18,46.35
  Bottom 0.305: v61.18,46.35 61.81,45.72 61.81,43.18 59.91,41.27 59.91,35.56 v64.35,31.11
PG5  (via drill 0.5)
  Top 0.305: U4.90 35.4,44.83 v35.14,45.09 | v34.51,59.69 35.14,60.33 56.1,60.33 58,58.42 79.59,58.42 82.13,55.88 82.13,52.7 81.31,51.88 IC3.42
  Bottom 0.305: v35.14,45.09 34.51,45.72 v34.51,59.69
PG10  (via drill 0.5)  (1 unrouted)
  Top 0.305: IC3.6 v57.96,49.48 | v56.1,59.05 55.46,59.69 35.78,59.69 35.14,59.05 35.14,57.78 35.78,57.15 36.41,57.15 36.54,57.02 U4.125
  Bottom 0.305: v57.96,49.48 58,50.8 58,57.15 v56.1,59.05
R_IN  (5 unrouted)
R_OUT  (2 unrouted)
SWCLK  (via drill 0.5)  (1 unrouted)
  Top 0.305: U4.109 45.23,55.8 v45.3,55.88
  Bottom 0.305: v45.3,55.88 45.3,65.41
SWDIO  (via drill 0.5)  (1 unrouted)
  Top 0.305: U4.105 45.05,52.32 v44.03,53.34
  Bottom 0.305: v44.03,53.34 44.03,65.41
SWO  (1 unrouted)
UART_RX  (1 unrouted)
UART_TX  (1 unrouted)
USB_DM  (via drill 0.5)  (1 unrouted)
  Top 0.305: U4.103 49.64,51.33 v52.92,54.61
  Bottom 0.305: v52.92,54.61 52.92,63.5
USB_DP  (via drill 0.5)  (1 unrouted)
  Top 0.305: U4.104 48.88,51.84 v51.65,54.61
  Bottom 0.305: v51.65,54.61 52.29,55.24 52.29,63.5
USB_ID  (via drill 0.5)  (1 unrouted)
  Top 0.305: U4.102 50.41,50.83 v54.19,54.61
  Bottom 0.305: v54.19,54.61 54.19,63.5
USB_VBUS  (via drill 0.5)  (3 unrouted)
  Top 0.305: U4.101 51.19,50.34 v55.46,54.61
  Bottom 0.305: v55.46,54.61 54.83,55.24 54.83,63.5
VCC/2  (4 unrouted)
VDD  (5 unrouted)
VDDA
  Top 0.305: U4.33 26.5,37.85 26.89,37.47 26.89,36.2 24.35,33.66 L3.1 C18.1

### Text on the board
tPlace: OWL Rev02 | 5v | gnd | 3v3 | GND | 3V3 | Rebel Technology | PA3 | PA4 | PA5 | PA6 | PA7 | PC4 | PC5 | PB0 | PB1 | PB2